# EAGLE design SDBPS (EAGLE 5.06)
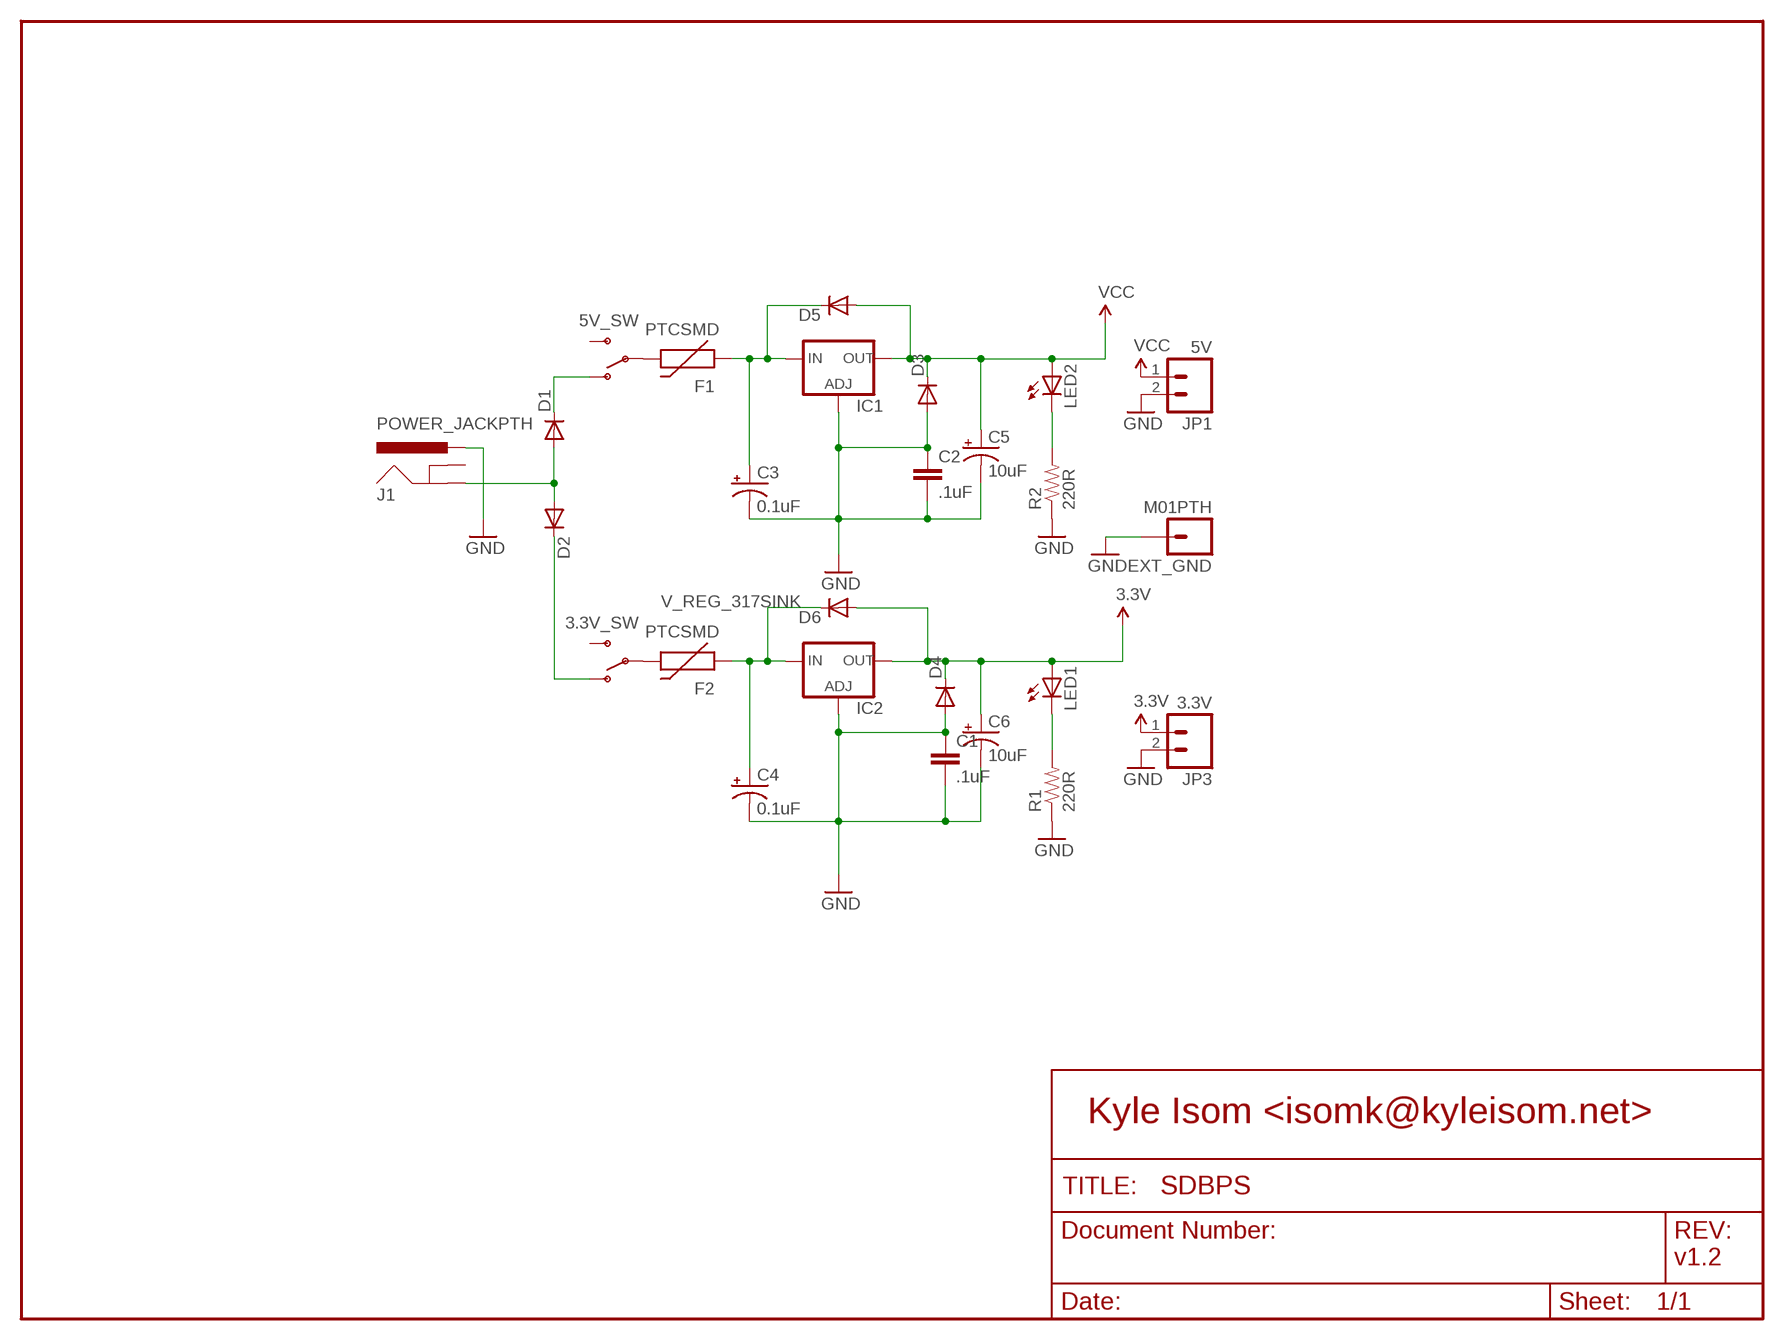
[diagram p0: schematic, sheet 1]

## Parts
3.3V_SW  SWITCH-SPSTSMD2  [SWITCH-SPDT-SMD]
5V_SW  SWITCH-SPSTSMD2  [SWITCH-SPDT-SMD]
C1  .1uF  CAP0603-CAP  [0603-CAP]
C2  .1uF  CAP0603-CAP  [0603-CAP]
C3  0.1uF  CAP_POL1206  [EIA3216]
C4  0.1uF  CAP_POL1206  [EIA3216]
C5  10uF  CAP_POL7343  [EIA7343]
C6  10uF  CAP_POL7343  [EIA7343]
D1  DIODESOD  [SOD-323]
D2  DIODESOD  [SOD-323]
D3  DIODESOD  [SOD-323]
D4  DIODESOD  [SOD-323]
D5  DIODESOD  [SOD-323]
D6  DIODESOD  [SOD-323]
EXT_GND  M01PTH  [1X01]
F1  PTCSMD  [PTC-1206]
F2  PTCSMD  [PTC-1206]
IC1  V_REG_317SINK  [TO220-ADJ]
IC2  V_REG_317SINK  [TO220-ADJ]
J1  POWER_JACKPTH  [POWER_JACK_PTH]
JP1  5V  M02POLAR_LOCK  [MOLEX-1X2_LOCK]
JP3  3.3V  M02POLAR_LOCK  [MOLEX-1X2_LOCK]
LED1  LEDCHIP-LED0603  [CHIP-LED0603]
LED2  LEDCHIP-LED0603  [CHIP-LED0603]
R1  220R  RESISTOR0603-RES  [0603-RES]
R2  220R  RESISTOR0603-RES  [0603-RES]

## Nets
3.3V: C6.A(+) D4.1(C) D6.2(A) IC2.OUT JP3.1 LED1.A
GND: C1.1 C1.2 C2.1 C2.2 C3.C(-) C4.C(-) C5.C(-) C6.C(-) D3.2(A) D4.2(A) EXT_GND.1 IC1.ADJ IC2.ADJ J1.PWR JP1.2 JP3.2 R1.1 R2.1
N$1: D1.2(A) D2.2(A) J1.GND
N$2: 5V_SW.2(P) F1.2
N$3: 3.3V_SW.2(P) F2.2
N$4: 5V_SW.1(O) D1.1(C)
N$5: 3.3V_SW.1(O) D2.1(C)
N$6: C3.A(+) D5.1(C) F1.1 IC1.IN
N$7: C4.A(+) D6.1(C) F2.1 IC2.IN
N$12: LED2.C R2.2
N$14: LED1.C R1.2
VCC: C5.A(+) D3.1(C) D5.2(A) IC1.OUT JP1.1 LED2.A
Unconnected: 3.3V_SW.3(S) 5V_SW.3(S) J1.GNDBREAK

## Notes on the sheet
- Kyle Isom <isomk@kyleisom.net>
- v1.2

## Library data of the parts
3.3V_SW 5V_SW = SparkFun:SWITCH-SPST: SPST Switch Simple slide switch. Spark Fun Electronics SKU : COM-00102
C1 C2 = SparkFun:CAP: Capacitor Standard 0603 ceramic capacitor, and 0.1" leaded capacitor.
C3-C6 = SparkFun:CAP_POL: Capacitor Polarized These are standard SMD and PTH capacitors. Normally 10uF, 47uF, and 100uF in electrolytic and tantalum varieties. Always verify the external diameter of the through hole cap, it varies with capacity, voltage, and manufacturer. The EIA devices should be standard.
D1-D6 = SparkFun:DIODE: Diode These are standard reverse protection diodes and small signal diodes. SMA package can handle up to about 1A. SOD-323 can handle about 200mA. What the SOD-323 package when ordering, there are some mfgs out there that are 5-pin packages.
EXT_GND = SparkFun:M01: Header 1 Standard 1-pin 0.1" header. Use with straight break away headers (SKU : PRT-00116), right angle break away headers (PRT-00553), swiss pins (PRT-00743), machine pins (PRT-00117), and female headers (PRT-00115).
F1 F2 = SparkFun:PTC: Resettable Fuse PTC Resettable Fuse. Spark Fun Electronics SKU : COM-08357
IC1 IC2 = SparkFun:V_REG_317: Voltage Regulator Standard LM317 adjustable voltage regulator. AOI (Adjust Output Input). Google 'LM317 Calculator' for easy to use app to get the two resistor values needed. 240/720 for 5V output. 240/390 for 3.3V output. Spark Fun Electronics SKU : COM-00527
J1 = SparkFun:POWER_JACK: Power Jack This is the standard 5.5mm barrel jack for power. The PTH is the most common, proven, reliable, footprint. All others are experimental. The Slot footprint only works if the mill layer is transmitted to the PCB fab house so be warned. Spark Fun Electronics SKU : PRT-00119. Mating wall wart : TOL-00298 (and others)
JP1 JP3 = SparkFun:M02: Header 2 Standard 2-pin 0.1" header. Use with straight break away headers (SKU : PRT-00116), right angle break away headers (PRT-00553), swiss pins (PRT-00743), machine pins (PRT-00117), and female headers (PRT-00115). Molex polarized connector foot print use with SKU : PRT-08233 with associated crimp pins and housings.
LED1 LED2 = led:LED: LED OSRAM: - CHIPLED LG R971, LG N971, LY N971, LG Q971, LY Q971, LO R971, LY R971 LH N974, LH R974 LS Q976, LO Q976, LY Q976 LO Q996 - Hyper CHIPLED LW Q18S LB Q993, LB Q99A, LB R99A - SideLED LS A670, LO A670, LY A670, LG A670, LP A670 LB A673, LV A673, LT A673, LW A673 LH A674 LY A675 LS A676, LA A676, LO A676, LY A676, LW A676 LS A679, LY A679, LG A679 - Hyper Micro SIDELED® LS Y876, LA Y876, LO Y876, LY Y876 LT Y87S - SmartLED LW L88C, LW L88S LB L89C, LB L89S, LG L890 LS L89K, LO L89K, LY L89K LS L896, LA L896, LO L896, LY L896 - TOPLED LS T670, LO T670, LY T670, LG T670, LP T670 LSG T670, LSP T670, LSY T670, LOP T670, LYG T670 LG T671, LOG T671, LSG T671 LB T673, LV T673, LT T673, LW T673 LH T674 LS T676, LA T676, LO T676, LY T676, LB T676, LH T676, LSB T676, LW T676 LB T67C, LV T67C, LT T67C, LS T67K, LO T67K, LY T67K, LW E67C LS E67B, LA E67B, LO E67B, LY E67B, LB E67C, LV E67C, LT E67C LW T67C LS T679, LY T679, LG T679 LS T770, LO T770, LY T770, LG T770, LP T770 LB T773, LV T773, LT T773, LW T773 LH T774 LS E675, LA E675, LY E675, LS T675 LS T776, LA T776, LO T776, LY T776, LB T776 LHGB T686 LT T68C, LB T68C - Hyper Mini TOPLED® LB M676 - Mini TOPLED Santana® LG M470 LS M47K, LO M47K, LY M47K Source: http://www.osram.convergy.de LUXEON: - LUMILED® LXK2-PW12-R00, LXK2-PW12-S00, LXK2-PW14-U00, LXK2-PW14-V00 LXK2-PM12-R00, LXK2-PM12-S00, LXK2-PM14-U00 LXK2-PE12-Q00, LXK2-PE12-R00, LXK2-PE12-S00, LXK2-PE14-T00, LXK2-PE14-U00 LXK2-PB12-K00, LXK2-PB12-L00, LXK2-PB12-M00, LXK2-PB14-N00, LXK2-PB14-P00, LXK2-PB14-Q00 LXK2-PR12-L00, LXK2-PR12-M00, LXK2-PR14-Q00, LXK2-PR14-R00 LXK2-PD12-Q00, LXK2-PD12-R00, LXK2-PD12-S00 LXK2-PH12-R00, LXK2-PH12-S00 LXK2-PL12-P00, LXK2-PL12-Q00, LXK2-PL12-R00 Source: www.luxeon.com KINGBRIGHT: KA-3528ASYC Source: www.kingbright.com
R1 R2 = SparkFun:RESISTOR: Resistor Basic schematic elements and footprints for 0603, 1206, and PTH 1/10th watt (small) resistors.

## Board
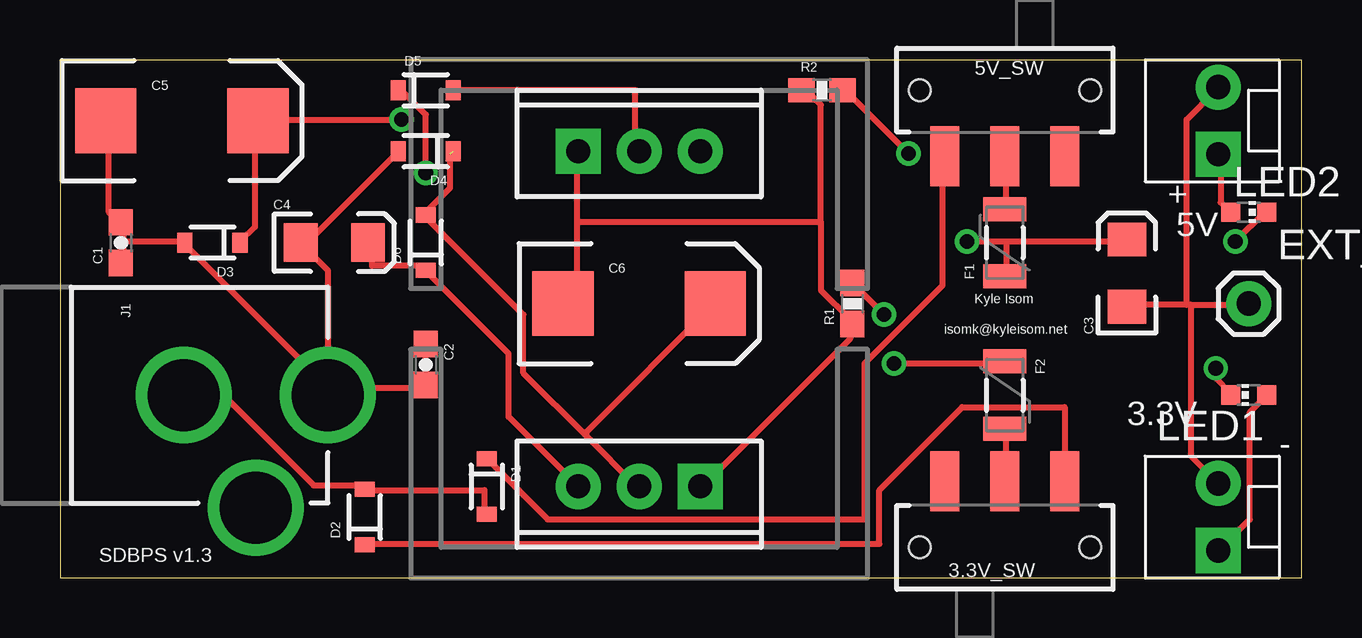
[diagram p1: board, top side]
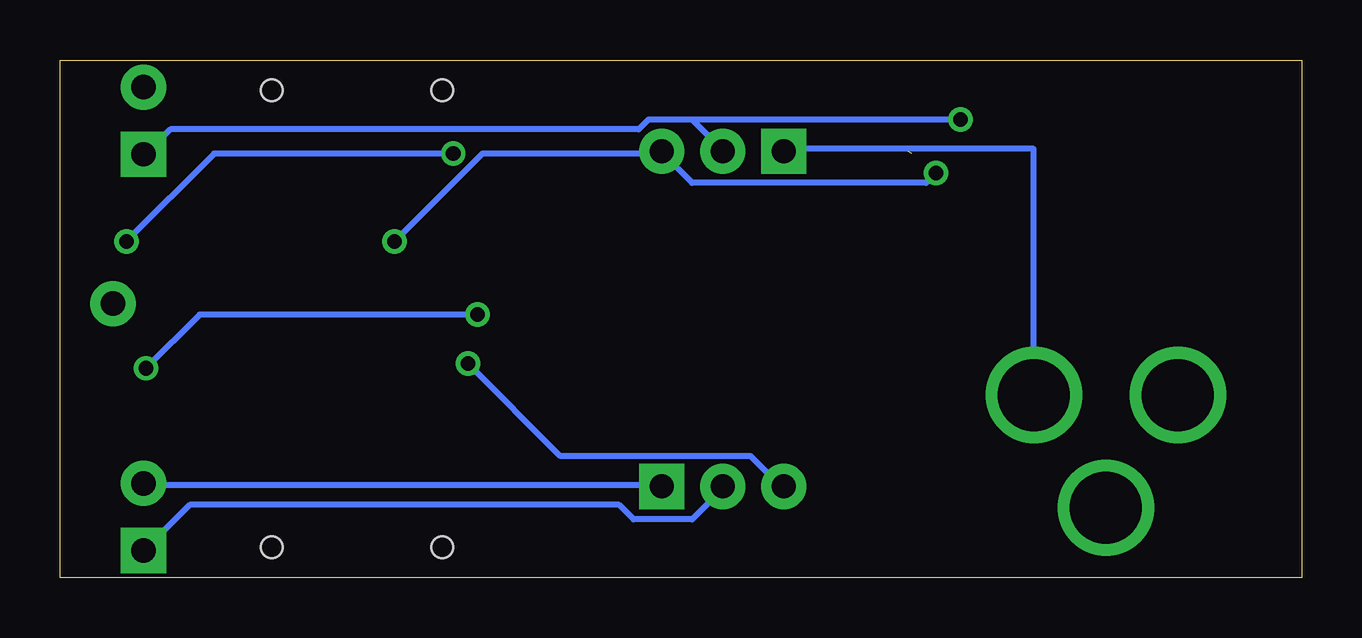
[diagram p2: board, bottom side, seen from below]

Size 51.74 x 21.58 mm. Coordinates in mm from the lower left corner, seen from the top.
Outline: 0,0 51.74,0 51.74,21.58 0,21.58 0,0
Copper layers (1*16): Top 0.035mm / dielectric 1.5mm / Bottom 0.035mm
Design rules "default": minimum track width 10mil, minimum drill 24mil, track to track 8mil, track to pad 8mil, pad to pad 8mil, via to via 8mil, smd to smd 8mil, copper to edge 40mil, drill to drill 8mil, minimum pad ring 10mil, minimum via ring 8mil, stop-mask expansion 4mil, vias tented up to drill 0mil, thermal gap 10mil

### Footprints (pad centres in the part's own frame; a part is rotated, then mirrored left to right if it is on the bottom)
SWITCH-SPDT-SMD = smd 1.2 x 2.5: 1 -2.5,-2.75; 2 0,-2.75; 3 2.5,-2.75 | hole 0.9: -3.55,0; 3.55,0
0603-CAP = smd 1.1 x 1: 1 -0.85,0; 2 0.85,0
EIA3216 = smd 1.4 x 1.6: A 1.4,0; C -1.4,0
EIA7343 = smd 2.55 x 2.7: A 3.17,0; C -3.17,0
SOD-323 = smd 0.63 x 0.83: 1 -1.15,0; 2 1.15,0
1X01 = drill 1.016 pad 1.88 round: 1 0,0
PTC-1206 = smd 1 x 1.8: 1 -1.4,0; 2 1.4,0
TO220-ADJ = drill 1 pad 1.88 square: ADJ -2.54,0 | drill 1 pad 1.88 round: IN 2.54,0; OUT 0,0
POWER_JACK_PTH = drill 2.997 round: GND 0,7.7; GNDBREAK 4.7,10.7; PWR 0,13.7
MOLEX-1X2_LOCK = drill 1.016 pad 1.88 square: 1 -0.127,0 | drill 1.016 pad 1.88 round: 2 2.667,0
CHIP-LED0603 = smd 0.8 x 0.8: A 0,-0.75; C 0,0.75
0603-RES = smd 1.1 x 1: 1 -0.85,0; 2 0.85,0

### Placement (x,y rotation side)
3.3V_SW  39.37,1.27 180 top
5V_SW  39.37,20.32 0 top
C1  2.54,13.97 90 top
C2  15.24,8.89 270 top
C3  44.45,12.7 90 top
C4  11.43,13.97 0 top
C5  5.08,19.05 0 top
C6  24.13,11.43 0 top
D1  17.78,3.81 270 top
D2  12.7,2.54 90 top
D3  6.35,13.97 180 top
D4  15.24,17.78 180 top
D5  15.24,20.32 0 top
D6  15.24,13.97 90 top
EXT_GND  49.53,11.43 0 top
F1  39.37,13.97 90 top
F2  39.37,7.62 270 top
IC1  24.13,17.78 0 top
IC2  24.13,3.81 180 top
J1  -2.54,7.62 270 top
JP1  48.26,17.78 90 top
JP3  48.26,1.27 90 top
LED1  49.53,7.62 90 top
LED2  49.53,15.24 270 top
R1  33.02,11.43 90 top
R2  31.75,20.32 0 top

### Tracks (layer width: path | path; a pad name or v marks a point on that pad's centre or on a via)
3.3V  (1 unrouted)
  Top 0.254: LED1.A 50.19,7.52 49.58,6.91 49.58,2.44 48.36,1.22 JP3.1 | 16.26,17.68 16.26,16.26 15.24,15.24 D6.2 15.24,15.04 19.3,10.97 19.3,8.53 21.95,5.89 | 21.95,5.89 23.98,3.86 IC2.OUT | 21.95,5.89 21.95,6.1 27.23,11.38 C6.A
  Bottom 0.254: JP3.1 48.16,1.22 46.33,3.05 28.45,3.05 27.84,2.44 25.4,2.44 24.18,3.66 IC2.OUT
GND
  Top 0.254: 2.64,14.02 5.08,14.02 D3.2 5.28,13.82 11.18,7.92 | 2.64,14.02 2.64,14.63 C1.2 2.44,14.83 2.03,15.24 2.03,18.9 C5.C | 2.64,14.02 2.64,13.21 C1.1 | 10.16,13.82 14.02,17.68 D4.2 | C2.1 C2.2 15.24,7.92 11.18,7.92 | 11.18,7.92 11.18,7.72 J1.PWR 11.18,7.92 | 10.16,13.82 11.18,12.8 11.18,7.92 | 10.16,13.82 C4.C | 47.14,11.38 49.38,11.38 EXT_GND.1 | 47.14,11.38 46.94,11.38 | 46.94,11.38 44.5,11.38 C3.C | 47.14,11.38 47.14,5.08 48.16,4.06 JP3.2 | 46.94,11.38 46.94,19.1 48.16,20.32 JP1.2 | 21.54,14.83 21.54,17.68 IC1.ADJ | 21.54,14.83 21.54,11.99 21.13,11.58 C6.C | 31.7,14.83 31.7,11.99 32.92,10.77 R1.1 32.92,10.57 32.92,9.96 26.82,3.86 IC2.ADJ | 31.7,14.83 31.7,19.71 31.09,20.32 R2.1 | 21.54,14.83 31.7,14.83
  Bottom 0.254: JP3.2 48.16,3.86 26.82,3.86 IC2.ADJ | J1.PWR 11.18,7.72 11.18,17.88 21.54,17.88 IC1.ADJ
N$1
  Top 0.254: D1.2 17.68,2.85 17.68,3.66 12.8,3.66 D2.2 12.6,3.86 10.57,3.86 6.91,7.52 5.28,7.52 J1.GND
N$2
  Top 0.254: F1.2 39.42,15.44 39.42,17.48 5V_SW.2
N$3
  Top 0.254: F2.2 39.42,6.1 39.42,4.06 3.3V_SW.2
N$4
  Top 0.254: D1.1 17.88,4.88 20.32,2.44 33.53,2.44 33.53,8.94 36.78,12.19 36.78,17.48 5V_SW.1
N$5
  Top 0.254: D2.1 12.8,1.42 34.14,1.42 34.14,3.66 37.59,7.11 41.86,7.11 41.86,4.06 3.3V_SW.1
N$6  (via drill 0.61)
  Top 0.254: 39.42,14.02 44.3,14.02 C3.A | 39.42,14.02 39.42,12.6 F1.1 | v15.24,16.87 15.24,19.3 14.22,20.32 D5.1 | v37.8,14.02 39.42,14.02
  Bottom 0.254: v15.24,16.87 15.65,16.46 25.4,16.46 26.62,17.68 IC1.IN 26.82,17.68 34.14,17.68 v37.8,14.02
N$7  (via drill 0.61)
  Top 0.254: C4.A 13.01,13.82 13.01,13.01 15.24,13.01 D6.1 15.24,12.8 18.69,9.35 18.69,6.71 IC2.IN | v34.75,8.94 39.22,8.94 F2.1
  Bottom 0.254: v34.75,8.94 30.89,5.08 22.96,5.08 21.74,3.86 IC2.IN
N$12  (via drill 0.61)
  Top 0.254: v48.97,14.02 50.19,15.24 LED2.C | v35.36,17.68 32.72,20.32 R2.2
  Bottom 0.254: v48.97,14.02 45.31,17.68 v35.36,17.68
N$14  (via drill 0.61)
  Top 0.254: v48.16,8.74 48.16,8.33 48.77,7.72 LED1.C | v34.34,10.97 33.12,12.19 R1.2
  Bottom 0.254: v48.16,8.74 45.92,10.97 v34.34,10.97
VCC  (via drill 0.61)
  Top 0.254: D3.1 7.52,14.02 8.13,14.63 8.13,18.9 C5.A 8.33,19.1 v14.22,19.1 | LED2.A 48.77,15.24 48.36,15.65 48.36,17.48 JP1.1 | D5.2 23.98,20.32 23.98,17.88 IC1.OUT
  Bottom 0.254: 25.4,19.1 27.23,19.1 27.64,18.69 47.14,18.69 48.16,17.68 JP1.1 | 25.4,19.1 24.18,17.88 IC1.OUT | v14.22,19.1 25.4,19.1

### Text on the board
tPlace: + | 5V | Kyle Isom | isomk@kyleisom.net | 3.3V | - | SDBPS v1.3